# EAGLE schematic schematic (EAGLE 9.6.2)
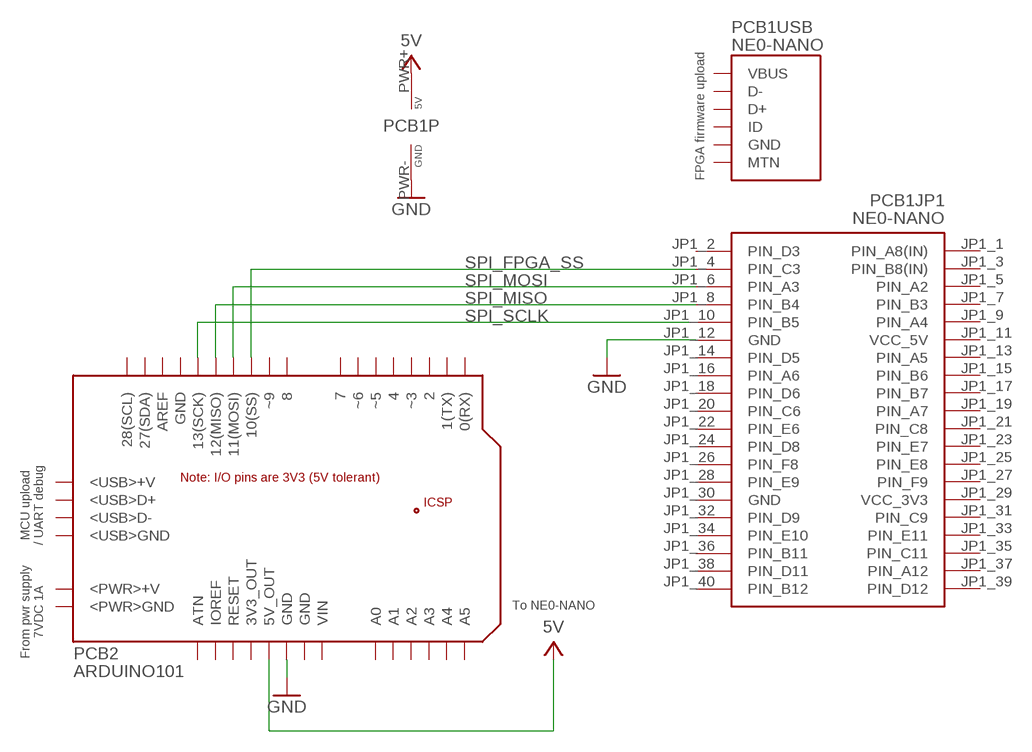
[diagram p0: schematic, sheet 1]

## Parts
PCB1  NE0-NANO  [NE0-NANO]
PCB2  ARDUINO101  [ARDUINO101]

## Nets
+5V: PCB1.PWR+(P:5V) PCB2.5V(5V_OUT) ; supply symbol labelled 5V
GND: PCB1.JP1_12(JP1:GND) PCB1.PWR-(P:GND) PCB2.GND..(GND)
SPI_FPGA_SS: PCB1.JP1_4(JP1:PIN_C3) PCB2.10(10(SS))
SPI_MISO: PCB1.JP1_8(JP1:PIN_B4) PCB2.12(12(MISO))
SPI_MOSI: PCB1.JP1_6(JP1:PIN_A3) PCB2.11(11(MOSI))
SPI_SCLK: PCB1.JP1_10(JP1:PIN_B5) PCB2.13(13(SCK))
Unconnected: PCB1.JP1_1(JP1:PIN_A8(IN)) PCB1.JP1_2(JP1:PIN_D3) PCB1.JP1_3(JP1:PIN_B8(IN)) PCB1.JP1_5(JP1:PIN_A2) PCB1.JP1_7(JP1:PIN_B3) PCB1.JP1_9(JP1:PIN_A4) PCB1.JP1_11(JP1:VCC_5V) PCB1.JP1_13(JP1:PIN_A5) PCB1.JP1_14(JP1:PIN_D5) PCB1.JP1_15(JP1:PIN_B6) PCB1.JP1_16(JP1:PIN_A6) PCB1.JP1_17(JP1:PIN_B7) PCB1.JP1_18(JP1:PIN_D6) PCB1.JP1_19(JP1:PIN_A7) PCB1.JP1_20(JP1:PIN_C6) PCB1.JP1_21(JP1:PIN_C8) PCB1.JP1_22(JP1:PIN_E6) PCB1.JP1_23(JP1:PIN_E7) PCB1.JP1_24(JP1:PIN_D8) PCB1.JP1_25(JP1:PIN_E8) PCB1.JP1_26(JP1:PIN_F8) PCB1.JP1_27(JP1:PIN_F9) PCB1.JP1_28(JP1:PIN_E9) PCB1.JP1_29(JP1:VCC_3V3) PCB1.JP1_30(JP1:GND) PCB1.JP1_31(JP1:PIN_C9) PCB1.JP1_32(JP1:PIN_D9) PCB1.JP1_33(JP1:PIN_E11) PCB1.JP1_34(JP1:PIN_E10) PCB1.JP1_35(JP1:PIN_C11) PCB1.JP1_36(JP1:PIN_B11) PCB1.JP1_37(JP1:PIN_A12) PCB1.JP1_38(JP1:PIN_D11) PCB1.JP1_39(JP1:PIN_D12) PCB1.JP1_40(JP1:PIN_B12) PCB1.JP2_1(JP2:PIN_T9(IN)) PCB1.JP2_2(JP2:PIN_F13) PCB1.JP2_3(JP2:PIN_R9(IN)) PCB1.JP2_4(JP2:PIN_T15) PCB1.JP2_5(JP2:PIN_T14) PCB1.JP2_6(JP2:PIN_T13) PCB1.JP2_7(JP2:PIN_R13) PCB1.JP2_8(JP2:PIN_T12) PCB1.JP2_9(JP2:PIN_R12) PCB1.JP2_10(JP2:PIN_T11) PCB1.JP2_11(JP2:VCC_5V) PCB1.JP2_12(JP2:GND) PCB1.JP2_13(JP2:PIN_T10) PCB1.JP2_14(JP2:PIN_R11) PCB1.JP2_15(JP2:PIN_P11) PCB1.JP2_16(JP2:PIN_R10) PCB1.JP2_17(JP2:PIN_N12) PCB1.JP2_18(JP2:PIN_P9) PCB1.JP2_19(JP2:PIN_N9) PCB1.JP2_20(JP2:PIN_N11) PCB1.JP2_21(JP2:PIN_L16) PCB1.JP2_22(JP2:PIN_K16) PCB1.JP2_23(JP2:PIN_R16) PCB1.JP2_24(JP2:PIN_L15) PCB1.JP2_25(JP2:PIN_P15) PCB1.JP2_26(JP2:PIN_P16) PCB1.JP2_27(JP2:PIN_R14) PCB1.JP2_28(JP2:PIN_N16) PCB1.JP2_29(JP2:VCC_3V3) PCB1.JP2_30(JP2:GND) PCB1.JP2_31(JP2:PIN_N15) PCB1.JP2_32(JP2:PIN_P14) PCB1.JP2_33(JP2:PIN_L14) PCB1.JP2_34(JP2:PIN_N14) PCB1.JP2_35(JP2:PIN_M10) PCB1.JP2_36(JP2:PIN_L13) PCB1.JP2_37(JP2:PIN_J16) PCB1.JP2_38(JP2:PIN_K15) PCB1.JP2_39(JP2:PIN_J13) PCB1.JP2_40(JP2:PIN_J14) PCB1.JP3_1(JP3:VCC_3.3V) PCB1.JP3_2(JP3:PIN_E15(IN)) PCB1.JP3_3(JP3:PIN_E16(IN)) PCB1.JP3_4(JP3:PIN_M16(IN)) PCB1.JP3_5(JP3:PIN_A14) PCB1.JP3_6(JP3:PIN_B16) PCB1.JP3_7(JP3:PIN_C14) PCB1.JP3_8(JP3:PIN_C16) PCB1.JP3_9(JP3:PIN_C15) PCB1.JP3_10(JP3:PIN_D16) PCB1.JP3_11(JP3:PIN_D15) PCB1.JP3_12(JP3:PIN_D14) PCB1.JP3_13(JP3:PIN_F15) PCB1.JP3_14(JP3:PIN_F16) PCB1.JP3_15(JP3:PIN_F14) PCB1.JP3_16(JP3:PIN_G16) PCB1.JP3_17(JP3:PIN_G15) PCB1.JP3_18(JP3:ANALOG_IN5) PCB1.JP3_19(JP3:ANALOG_IN6) PCB1.JP3_20(JP3:ANALOG_IN7) PCB1.JP3_21(JP3:ANALOG_IN3) PCB1.JP3_22(JP3:ANALOG_IN2) PCB1.JP3_23(JP3:ANALOG_IN4) PCB1.JP3_24(JP3:ANALOG_IN0) PCB1.JP3_25(JP3:ANALOG_IN1) PCB1.JP3_26(JP3:GND) PCB1.USB_D+(USB:D+) PCB1.USB_D-(USB:D-) PCB1.USB_GND(USB:GND) PCB1.USB_ID(USB:ID) PCB1.USB_MTN@1(USB:MTN) PCB1.USB_VBUS(USB:VBUS) PCB2.0(0(RX)) PCB2.1(1(TX)) PCB2.2 PCB2.3(~3) PCB2.4 PCB2.5(~5) PCB2.6(~6) PCB2.7 PCB2.8 PCB2.9(~9) PCB2.+5V PCB2.<PWR>+V PCB2.<PWR>-V(<PWR>GND) PCB2.<USB>D+ PCB2.<USB>D- PCB2.A0 PCB2.A1 PCB2.A2 PCB2.A3 PCB2.A4 PCB2.A5 PCB2.AREF PCB2.ATN PCB2.GND_ PCB2.I/OREF(IOREF) PCB2.MISO PCB2.MOSI PCB2.RESET PCB2.RESET. PCB2.SCK PCB2.SCL(28(SCL)) PCB2.SDA(27(SDA)) PCB2.VIN

## Notes on the sheet
- FPGA firmware upload
- MCU upload
  / UART debug
- To NE0-NANO
- From pwr supply
  7VDC 1A

## Power pins joined to a net without a drawn wire
3V3_OUT: PCB2.3.3V(3V3_OUT)
<USB>+V: PCB2.<USB>+V
<USB>GND: PCB2.<USB>GND
GND: PCB2.GND PCB2.GND.(GND)

## Library data of the parts
PCB1 = Coert Vonk:NE0-NANO
PCB2 = Coert Vonk:ARDUINO101: Schematic symbol for representing an Arduino/Genuino 101 board in an EAGLE schematic. Created by Dave Young for Element14. More 101 documentation at: https://www.element14.com/community/docs/DOC-80459/l/intel-genuino-101-development-board More EAGLE documentation at: http://www.element14.com/community/community/knode/cadsoft_eagle